# Altium schematic sheet eMMC.SchDoc
size 203 x 241 mm; SheetNumber: 4; SheetTotal: 4
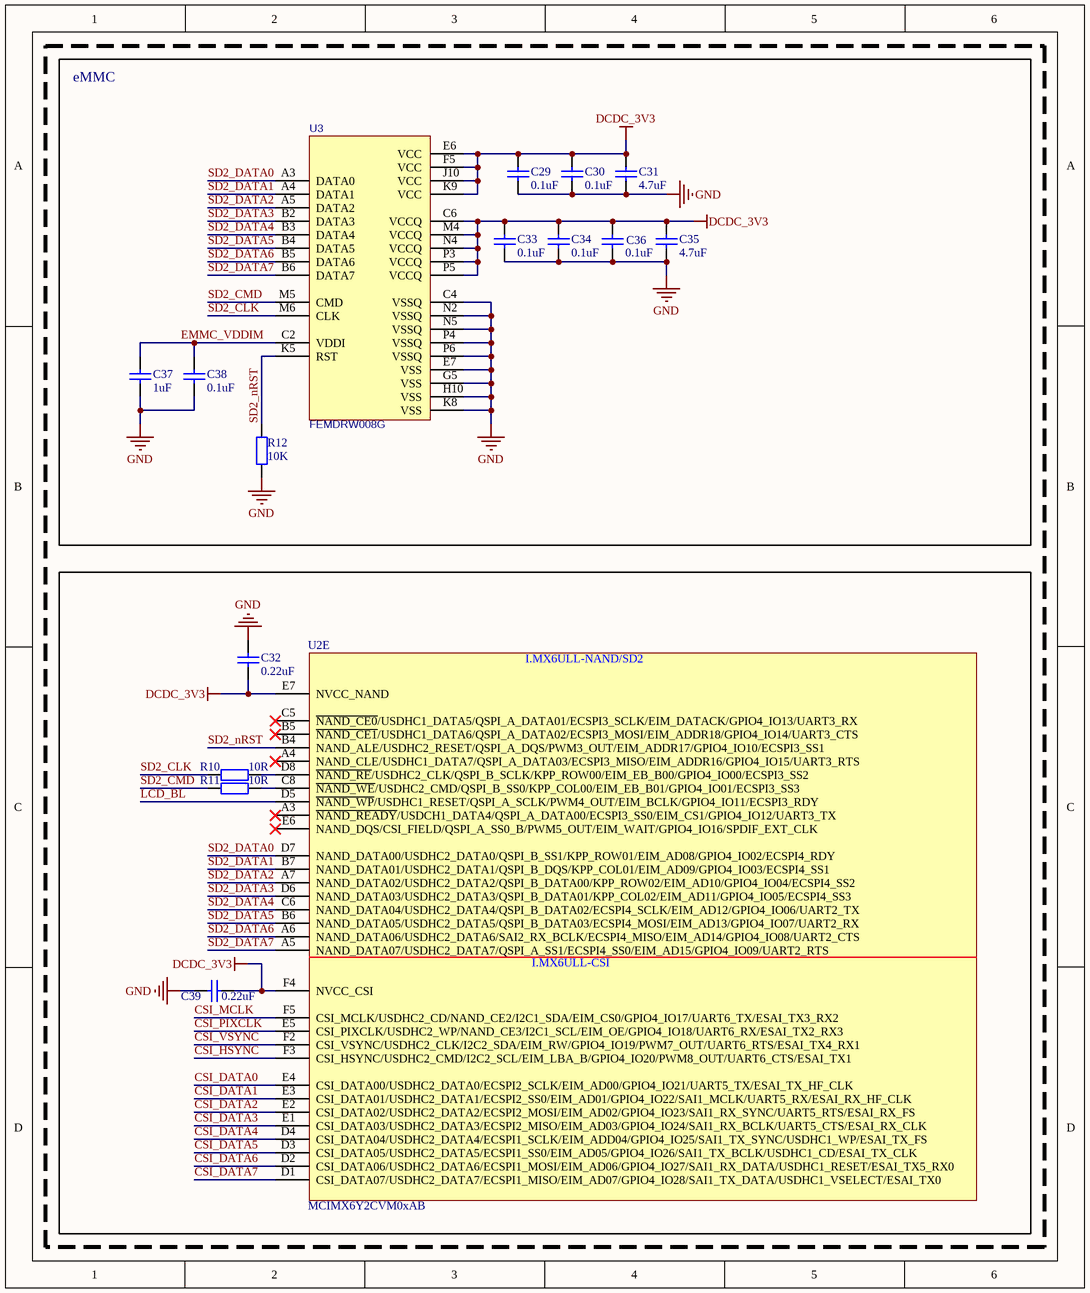
[diagram p0: eMMC.SchDoc]

## Parts
C29  0.1uF  [0402_C]
C30  0.1uF  [0402_C]
C31  4.7uF  [0402_C]
C32  0.22uF  [0402_C]
C33  0.1uF  [0402_C]
C34  0.1uF  [0402_C]
C35  4.7uF  [0402_C]
C36  0.1uF  [0402_C]
C37  1uF  [0402_C]
C38  0.1uF  [0402_C]
C39  0.22uF  [0402_C]
R10  10R  [0402_R]
R11  10R  [0402_R]
R12  10K  [0402_R]
U2  MCIMX6Y2CVM0xAB  [BGA289_17x17_0.8Pitch]  (part E of 5)
U3  FEMDRW008G  [BGA169  EMMC]

## Blocks framed on the sheet
eMMC: C29-C31 C33-C38 R12 U3

## Nets
DCDC_3V3: C29.2 C30.2 C31.2 C32.1 C33.2 C34.2 C35.2 C36.2 C39.1 U2.E7(NVCC_NAND) U2.F4(NVCC_CSI) U3.C6(VCCQ) U3.E6(VCC) U3.F5(VCC) U3.J10(VCC) U3.K9(VCC) U3.M4(VCCQ) U3.N4(VCCQ) U3.P3(VCCQ) U3.P5(VCCQ)
GND: C29.1 C30.1 C31.1 C32.2 C33.1 C34.1 C35.1 C36.1 C37.1 C38.1 C39.2 R12.1 U3.C4(VSSQ) U3.E7(VSS) U3.G5(VSS) U3.H10(VSS) U3.K8(VSS) U3.N2(VSSQ) U3.N5(VSSQ) U3.P4(VSSQ) U3.P6(VSSQ)
CSI_DATA0: U2.E4(CSI_DATA00/USDHC2_DATA0/ECSPI2_SCLK/EIM_AD00/GPIO4_IO21/UART5_TX/ESAI_TX_HF_CLK)
CSI_DATA1: U2.E3(CSI_DATA01/USDHC2_DATA1/ECSPI2_SS0/EIM_AD01/GPIO4_IO22/SAI1_MCLK/UART5_RX/ESAI_RX_HF_CLK)
CSI_DATA2: U2.E2(CSI_DATA02/USDHC2_DATA2/ECSPI2_MOSI/EIM_AD02/GPIO4_IO23/SAI1_RX_SYNC/UART5_RTS/ESAI_RX_FS)
CSI_DATA3: U2.E1(CSI_DATA03/USDHC2_DATA3/ECSPI2_MISO/EIM_AD03/GPIO4_IO24/SAI1_RX_BCLK/UART5_CTS/ESAI_RX_CLK)
CSI_DATA4: U2.D4(CSI_DATA04/USDHC2_DATA4/ECSPI1_SCLK/EIM_ADD04/GPIO4_IO25/SAI1_TX_SYNC/USDHC1_WP/ESAI_TX_FS)
CSI_DATA5: U2.D3(CSI_DATA05/USDHC2_DATA5/ECSPI1_SS0/EIM_AD05/GPIO4_IO26/SAI1_TX_BCLK/USDHC1_CD/ESAI_TX_CLK)
CSI_DATA6: U2.D2(CSI_DATA06/USDHC2_DATA6/ECSPI1_MOSI/EIM_AD06/GPIO4_IO27/SAI1_RX_DATA/USDHC1_RESET/ESAI_TX5_RX0)
CSI_DATA7: U2.D1(CSI_DATA07/USDHC2_DATA7/ECSPI1_MISO/EIM_AD07/GPIO4_IO28/SAI1_TX_DATA/USDHC1_VSELECT/ESAI_TX0)
CSI_HSYNC: U2.F3(CSI_HSYNC/USDHC2_CMD/I2C2_SCL/EIM_LBA_B/GPIO4_IO20/PWM8_OUT/UART6_CTS/ESAI_TX1)
CSI_MCLK: U2.F5(CSI_MCLK/USDHC2_CD/NAND_CE2/I2C1_SDA/EIM_CS0/GPIO4_IO17/UART6_TX/ESAI_TX3_RX2)
CSI_PIXCLK: U2.E5(CSI_PIXCLK/USDHC2_WP/NAND_CE3/I2C1_SCL/EIM_OE/GPIO4_IO18/UART6_RX/ESAI_TX2_RX3)
CSI_VSYNC: U2.F2(CSI_VSYNC/USDHC2_CLK/I2C2_SDA/EIM_RW/GPIO4_IO19/PWM7_OUT/UART6_RTS/ESAI_TX4_RX1)
EMMC_VDDIM: C37.2 C38.2 U3.C2(VDDI)
LCD_BL: U2.D5(~{NAND_WP}/USDHC1_RESET/QSPI_A_SCLK/PWM4_OUT/EIM_BCLK/GPIO4_IO11/ECSPI3_RDY)
SD2_CLK: R10.1 U3.M6(CLK)
SD2_CMD: R11.1 U3.M5(CMD)
SD2_DATA0: U2.D7(NAND_DATA00/USDHC2_DATA0/QSPI_B_SS1/KPP_ROW01/EIM_AD08/GPIO4_IO02/ECSPI4_RDY) U3.A3(DATA0)
SD2_DATA1: U2.B7(NAND_DATA01/USDHC2_DATA1/QSPI_B_DQS/KPP_COL01/EIM_AD09/GPIO4_IO03/ECSPI4_SS1) U3.A4(DATA1)
SD2_DATA2: U2.A7(NAND_DATA02/USDHC2_DATA2/QSPI_B_DATA00/KPP_ROW02/EIM_AD10/GPIO4_IO04/ECSPI4_SS2) U3.A5(DATA2)
SD2_DATA3: U2.D6(NAND_DATA03/USDHC2_DATA3/QSPI_B_DATA01/KPP_COL02/EIM_AD11/GPIO4_IO05/ECSPI4_SS3) U3.B2(DATA3)
SD2_DATA4: U2.C6(NAND_DATA04/USDHC2_DATA4/QSPI_B_DATA02/ECSPI4_SCLK/EIM_AD12/GPIO4_IO06/UART2_TX) U3.B3(DATA4)
SD2_DATA5: U2.B6(NAND_DATA05/USDHC2_DATA5/QSPI_B_DATA03/ECSPI4_MOSI/EIM_AD13/GPIO4_IO07/UART2_RX) U3.B4(DATA5)
SD2_DATA6: U2.A6(NAND_DATA06/USDHC2_DATA6/SAI2_RX_BCLK/ECSPI4_MISO/EIM_AD14/GPIO4_IO08/UART2_CTS) U3.B5(DATA6)
SD2_DATA7: U2.A5(NAND_DATA07/USDHC2_DATA7/QSPI_A_SS1/ECSPI4_SS0/EIM_AD15/GPIO4_IO09/UART2_RTS) U3.B6(DATA7)
SD2_nRST: R12.2 U2.B4(NAND_ALE/USDHC2_RESET/QSPI_A_DQS/PWM3_OUT/EIM_ADDR17/GPIO4_IO10/ECSPI3_SS1) U3.K5(RST)
NetR10_2: R10.2 U2.D8(~{NAND_RE}/USDHC2_CLK/QSPI_B_SCLK/KPP_ROW00/EIM_EB_B00/GPIO4_IO00/ECSPI3_SS2)
NetR11_2: R11.2 U2.C8(~{NAND_WE}/USDHC2_CMD/QSPI_B_SS0/KPP_COL00/EIM_EB_B01/GPIO4_IO01/ECSPI3_SS3)

Not connected (* = marked no-connect by the designer): U2 A3(~{NAND_READY}/USDCH1_DATA4/QSPI_A_DATA00/ECSPI3_SS0/EIM_CS1/GPIO4_IO12/UART3_TX)* A4(NAND_CLE/USDHC1_DATA7/QSPI_A_DATA03/ECSPI3_MISO/EIM_ADDR16/GPIO4_IO15/UART3_RTS)* B5(~{NAND_CE1}/USDHC1_DATA6/QSPI_A_DATA02/ECSPI3_MOSI/EIM_ADDR18/GPIO4_IO14/UART3_CTS)* C5(~{NAND_CE0}/USDHC1_DATA5/QSPI_A_DATA01/ECSPI3_SCLK/EIM_DATACK/GPIO4_IO13/UART3_RX)* E6(NAND_DQS/CSI_FIELD/QSPI_A_SS0_B/PWM5_OUT/EIM_WAIT/GPIO4_IO16/SPDIF_EXT_CLK)*

## Notes on the sheet
- (in symbol MCIMX6Y2CVM0xAB, part E) I.MX6ULL-NAND/SD2; I.MX6ULL-CSI

## Library data of the parts
C29-C39 = 0402_C: 贴片电容; ComponentLink1Description: 供应商链接; ComponentLink1URL: http://www.szlcsc.com/product/details_1928.html; Package: 0402; Supplier: LC; SuppliersPartNumber: C1576
R10-R12 = 0402_R: 贴片电阻; ComponentLink1Description: 供应商链接; ComponentLink1URL: http://www.szlcsc.com/product/details_26667.html; Package: 0402; Supplier: LC; SuppliersPartNumber: C25924
U3 = FEMDRW008G: BOM_Manufacturer: Samsung; BOM_Manufacturer Part: KLM8G1GETF-B041; Contributor: LCSC; BOM_Supplier: LCSC; BOM_Supplier Part: C499918; BOM_JLCPCB Part Class: Extended Part; spicePre: U; spiceSymbolName: KLM8G1GETF-B041